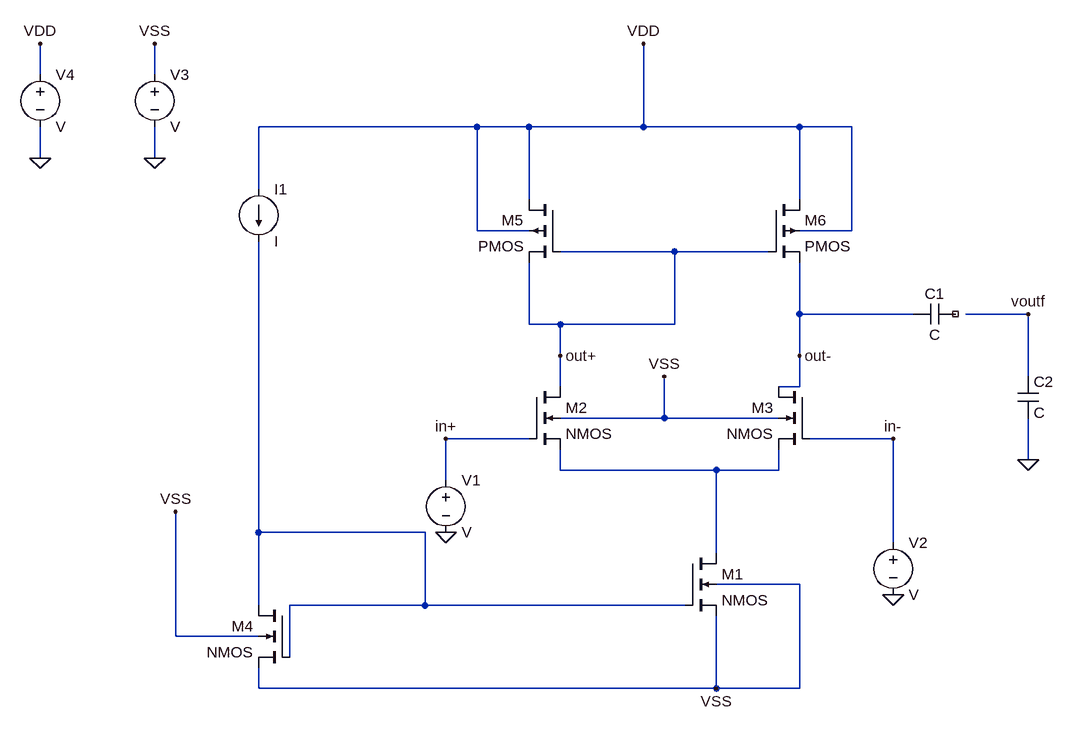
[diagram p0: schematic Draft1.asc]
Draft1.asc, the LTspice schematic file:
Version 4
SHEET 1 880 680
WIRE -752 -976 -752 -1024
WIRE -576 -976 -576 -1024
WIRE -80 -896 -416 -896
WIRE 0 -896 -80 -896
WIRE 176 -896 176 -1024
WIRE 176 -896 0 -896
WIRE 416 -896 176 -896
WIRE 496 -896 416 -896
WIRE -752 -848 -752 -896
WIRE -576 -848 -576 -896
WIRE -416 -800 -416 -896
WIRE 0 -784 0 -896
WIRE 416 -784 416 -896
WIRE -80 -736 -80 -896
WIRE 0 -736 -80 -736
WIRE 496 -736 496 -896
WIRE 496 -736 416 -736
WIRE 224 -704 48 -704
WIRE 368 -704 224 -704
WIRE 416 -608 416 -688
WIRE 592 -608 416 -608
WIRE 768 -608 672 -608
WIRE 0 -592 0 -688
WIRE 48 -592 0 -592
WIRE 224 -592 224 -704
WIRE 224 -592 48 -592
WIRE 48 -544 48 -592
WIRE 416 -544 416 -608
WIRE 768 -512 768 -608
WIRE 48 -496 48 -544
WIRE 416 -496 416 -544
WIRE 416 -496 384 -496
WIRE 208 -448 208 -512
WIRE 208 -448 48 -448
WIRE 384 -448 208 -448
WIRE 0 -416 -128 -416
WIRE 560 -416 432 -416
WIRE 768 -384 768 -448
WIRE 48 -368 48 -400
WIRE 288 -368 48 -368
WIRE 384 -368 384 -400
WIRE 384 -368 288 -368
WIRE -128 -352 -128 -416
WIRE -416 -272 -416 -720
WIRE -160 -272 -416 -272
WIRE 560 -256 560 -416
WIRE 288 -240 288 -368
WIRE 416 -192 288 -192
WIRE -416 -160 -416 -272
WIRE -160 -160 -160 -272
WIRE -160 -160 -368 -160
WIRE 240 -160 -160 -160
WIRE -544 -112 -544 -304
WIRE -416 -112 -544 -112
WIRE -368 -80 -368 -160
WIRE -416 -32 -416 -64
WIRE 288 -32 288 -144
WIRE 288 -32 -416 -32
WIRE 416 -32 416 -192
WIRE 416 -32 288 -32
FLAG -128 -272 0
FLAG 288 -32 VSS
FLAG -544 -304 VSS
FLAG 768 -608 voutf
FLAG 768 -384 0
FLAG 560 -416 in-
FLAG 560 -176 0
FLAG -128 -416 in+
FLAG 176 -1024 VDD
FLAG 208 -512 VSS
FLAG -576 -1024 VSS
FLAG -752 -1024 VDD
FLAG -752 -848 0
FLAG -576 -848 0
FLAG 416 -544 out-
FLAG 48 -544 out+
SYMBOL voltage -128 -368 R0
SYMATTR InstName V1
SYMBOL cap 592 -592 R270
WINDOW 0 32 32 VTop 2
WINDOW 3 0 32 VBottom 2
SYMATTR InstName C1
SYMBOL cap 752 -512 R0
SYMATTR InstName C2
SYMBOL voltage 560 -272 R0
SYMATTR InstName V2
SYMBOL pmos4 368 -784 R0
SYMATTR InstName M6
SYMBOL pmos4 48 -784 M0
SYMATTR InstName M5
SYMBOL nmos4 240 -240 R0
SYMATTR InstName M1
SYMBOL nmos4 0 -496 R0
SYMATTR InstName M2
SYMBOL nmos4 432 -496 M0
SYMATTR InstName M3
SYMBOL nmos4 -368 -160 M0
SYMATTR InstName M4
SYMBOL voltage -576 -992 R0
SYMATTR InstName V3
SYMBOL voltage -752 -992 R0
SYMATTR InstName V4
SYMBOL current -416 -800 R0
SYMATTR InstName I1

The netlist it stands for:
* Draft1.asc
V1 in+ 0 V
C1 out- NC_01 C
C2 voutf 0 C
V2 in- 0 V
M6 VDD out+ out- VDD PMOS
M5 VDD out+ out+ VDD PMOS
M1 N001 N002 VSS VSS NMOS
M2 out+ in+ N001 VSS NMOS
M3 out- in- N001 VSS NMOS
M4 N002 N002 VSS VSS NMOS
V3 VSS 0 V
V4 VDD 0 V
I1 VDD N002 I
.model NMOS NMOS
.model PMOS PMOS
.lib standard.mos
.backanno
.end